# EAGLE design actuator (EAGLE 9.6.2)
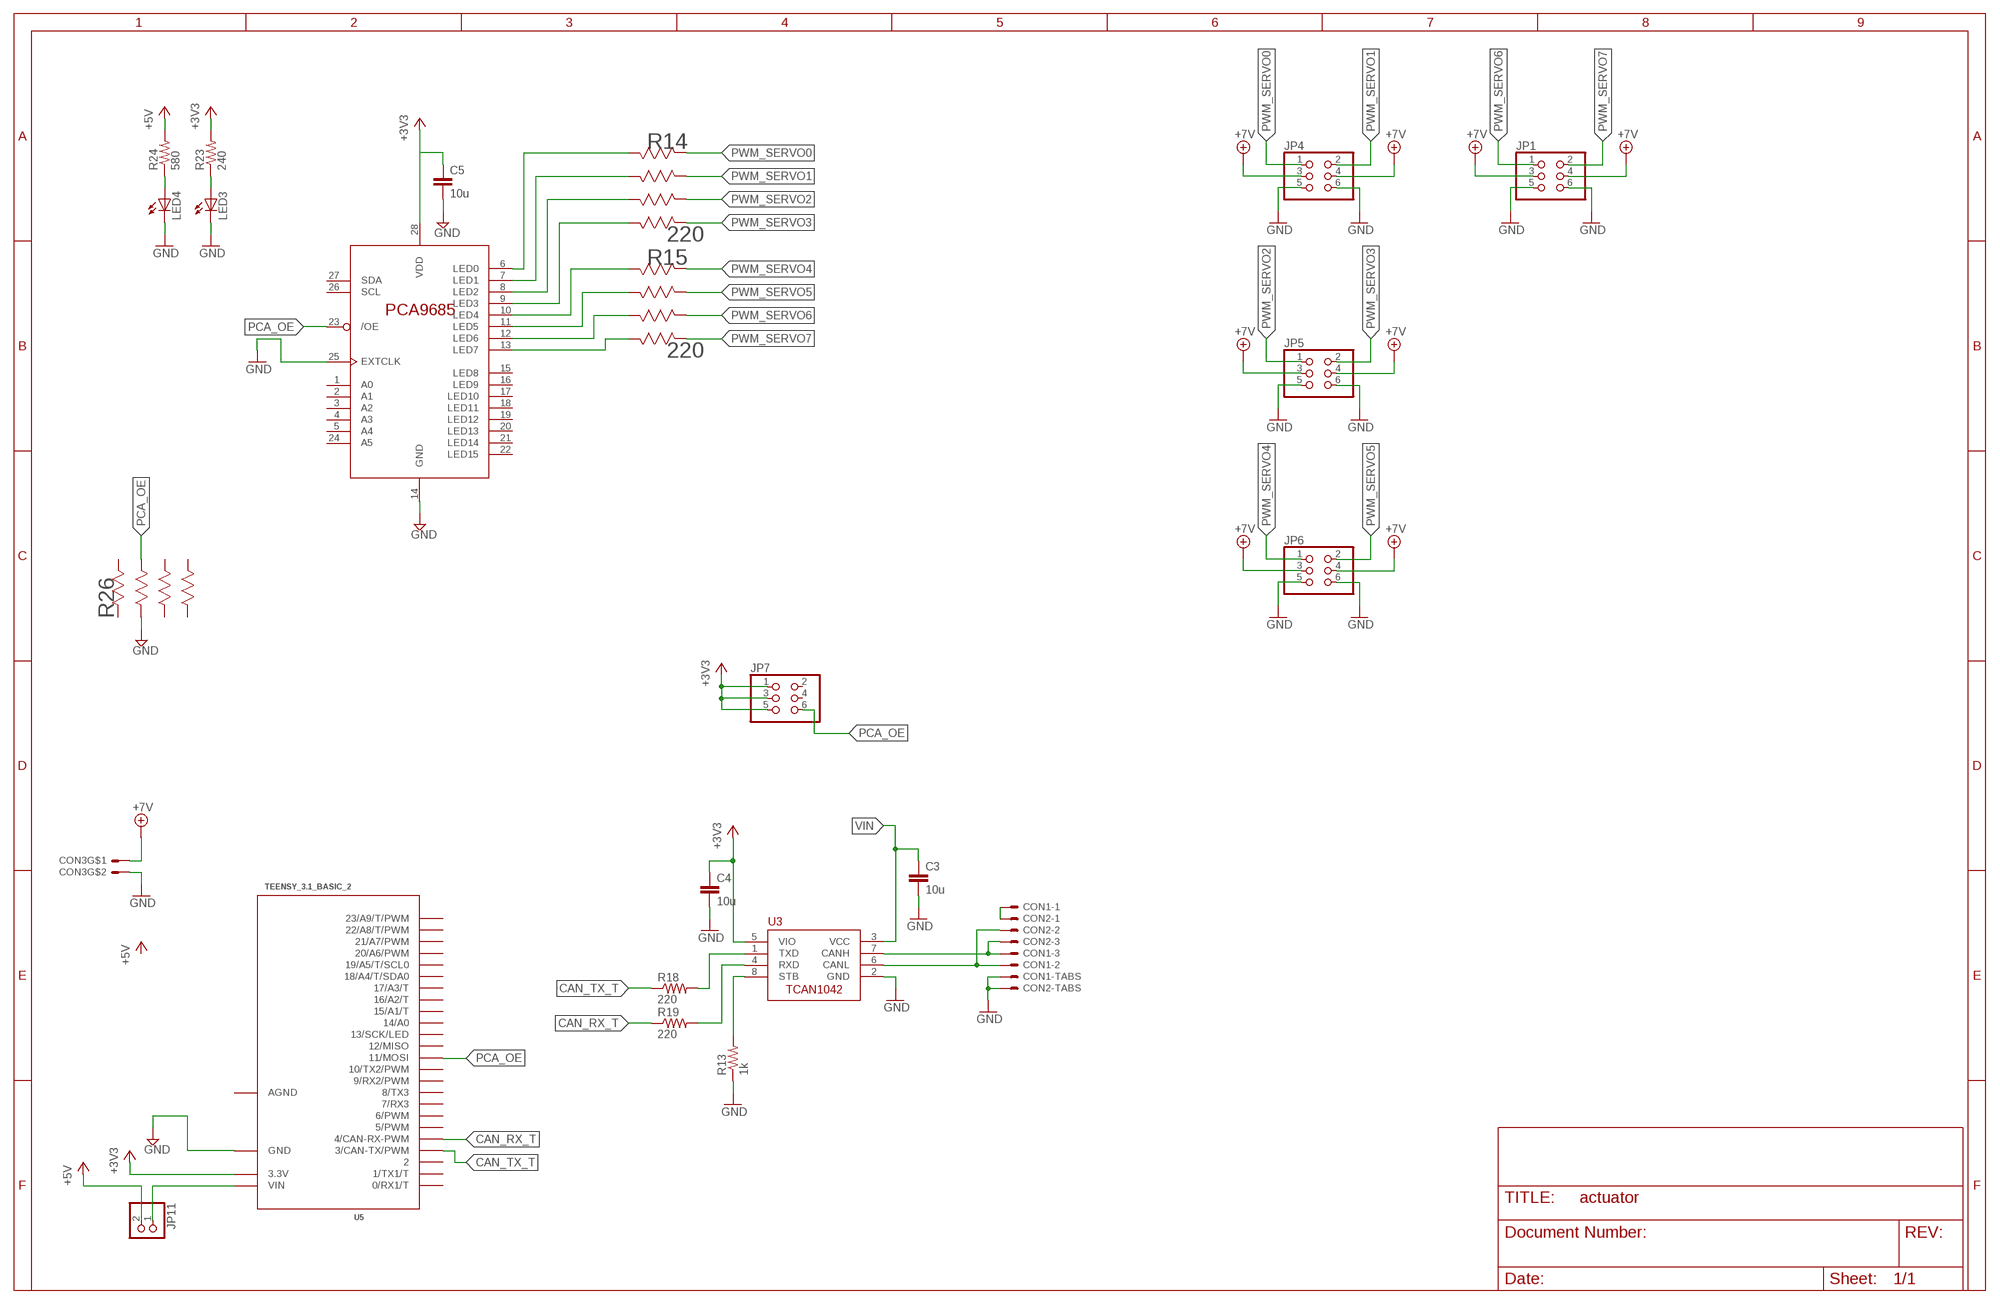
[diagram p0: schematic, sheet 1]

## Parts
C3  10u  C-EUC0805  [C0805]
C4  10u  C-EUC0805  [C0805]
C5  10u  C-EUC0805  [C0805]
CON1  SM03B-GHS-TB  [SM03B-GHS-TB]
CON2  SM03B-GHS-TB  [SM03B-GHS-TB]
CON3  MOLEX_5566-2  [5566-2]
JP1  PINHD-2X3  [2X03]
JP4  PINHD-2X3  [2X03]
JP5  PINHD-2X3  [2X03]
JP6  PINHD-2X3  [2X03]
JP7  PINHD-2X3  [2X03]
JP11  PINHD-1X2  [1X02]
LED3  LEDCHIPLED_1206  [CHIPLED_1206]
LED4  LEDCHIPLED_1206  [CHIPLED_1206]
R13  1k  R-US_R0805  [R0805]
R14  220  EXB-V8V221JVEXBV8V-M  [EXBV8V-M]
R15  220  EXB-V8V221JVEXBV8V-M  [EXBV8V-M]
R18  220  R-US_R0805  [R0805]
R19  220  R-US_R0805  [R0805]
R23  240  R-US_R1206  [R1206]
R24  580  R-US_R1206  [R1206]
R26  10k  EXB-V8V221JVEXBV8V-M  [EXBV8V-M]
U3  TCAN1042HVDR  [SO-8]
U4  PCA9685PW  [TSSOP28]
U5  TEENSY_3.1_BASIC_2  [TEENSY_3.1_BASIC_2]

## Nets
+3V3: C4.1 C5.1 JP7.1 JP7.3 JP7.5 R23.2 U3.5(VIO) U4.28(VDD) U5.3.3V
+5V: JP11.2 R24.2
+7V: CON3.1 JP1.3 JP1.4 JP4.3 JP4.4 JP5.3 JP5.4 JP6.3 JP6.4
CAN_RX: R19.2 U3.4(RXD)
CAN_RX_T: R19.1 U5.4(4/CAN-RX-PWM)
CAN_TX1: R18.2 U3.1(TXD)
CAN_TX_T: R18.1 U5.3(3/CAN-TX/PWM)
CANH: CON1.P$3 CON2.P$3 U3.7(CANH)
CANL: CON1.P$2 CON2.P$2 U3.6(CANL)
CANSH: CON1.P$1 CON2.P$1
GND [net1]: C3.2 C4.2 C5.2 CON1.P$4 CON1.P$5 CON2.P$4 CON2.P$5 CON3.2 JP1.5 JP1.6 JP4.5 JP4.6 JP5.5 JP5.6 JP6.5 JP6.6 LED3.C LED4.C R13.1 R26.2 U3.2(GND) U4.14(GND) U4.25(EXTCLK) U5.GND
N$3: LED3.A R23.1
N$4: LED4.A R24.1
PCA_OE: JP7.6 R26.7 U4.23(/OE) U5.11(11/MOSI)
PWM_CH0: R14.8 U4.6(LED0)
PWM_CH1: R14.7 U4.7(LED1)
PWM_CH2: R14.6 U4.8(LED2)
PWM_CH3: R14.5 U4.9(LED3)
PWM_CH4: R15.8 U4.10(LED4)
PWM_CH5: R15.7 U4.11(LED5)
PWM_CH6: R15.6 U4.12(LED6)
PWM_CH7: R15.5 U4.13(LED7)
PWM_SERVO0: JP4.1 R14.1
PWM_SERVO1: JP4.2 R14.2
PWM_SERVO2: JP5.1 R14.3
PWM_SERVO3: JP5.2 R14.4
PWM_SERVO4: JP6.1 R15.1
PWM_SERVO5: JP6.2 R15.2
PWM_SERVO6: JP1.1 R15.3
PWM_SERVO7: JP1.2 R15.4
STB: R13.2 U3.8(STB)
VIN: C3.1 JP11.1 U3.3(VCC) U5.VIN
Unconnected: JP7.2 JP7.4 R26.1 R26.3 R26.4 R26.5 R26.6 R26.8 U4.1(A0) U4.2(A1) U4.3(A2) U4.4(A3) U4.5(A4) U4.15(LED8) U4.16(LED9) U4.17(LED10) U4.18(LED11) U4.19(LED12) U4.20(LED13) U4.21(LED14) U4.22(LED15) U4.24(A5) U4.26(SCL) U4.27(SDA) U5.0(0/RX1/T) U5.1(1/TX1/T) U5.2 U5.5(5/PWM) U5.6(6/PWM) U5.7(7/RX3) U5.8(8/TX3) U5.9(9/RX2/PWM) U5.10(10/TX2/PWM) U5.12(12/MISO) U5.13(13/SCK/LED) U5.14/A0 U5.15/A1(15/A1/T) U5.16/A2(16/A2/T) U5.17/A3(17/A3/T) U5.18/A4(18/A4/T/SDA0) U5.19/A5(19/A5/T/SCL0) U5.20/A6(20/A6/PWM) U5.21/A7(21/A7/PWM) U5.22/A8(22/A8/T/PWM) U5.23/A9(23/A9/T/PWM)

## Power pins joined to a net without a drawn wire
AGND: U5.AGND

## Library data of the parts
C3-C5 = rcl:C-EU: CAPACITOR, European symbol
CON1 CON2 = ARVP:SM03B-GHS-TB
CON3 = ARVP:MOLEX_5566-2
JP1 JP4-JP7 = pinhead:PINHD-2X3: PIN HEADER
JP11 = pinhead:PINHD-1X2: PIN HEADER
LED3 LED4 = led:LED: LED OSRAM: - CHIPLED LG R971, LG N971, LY N971, LG Q971, LY Q971, LO R971, LY R971 LH N974, LH R974 LS Q976, LO Q976, LY Q976 LO Q996 - Hyper CHIPLED LW Q18S LB Q993, LB Q99A, LB R99A - SideLED LS A670, LO A670, LY A670, LG A670, LP A670 LB A673, LV A673, LT A673, LW A673 LH A674 LY A675 LS A676, LA A676, LO A676, LY A676, LW A676 LS A679, LY A679, LG A679 - Hyper Micro SIDELED® LS Y876, LA Y876, LO Y876, LY Y876 LT Y87S - SmartLED LW L88C, LW L88S LB L89C, LB L89S, LG L890 LS L89K, LO L89K, LY L89K LS L896, LA L896, LO L896, LY L896 - TOPLED LS T670, LO T670, LY T670, LG T670, LP T670 LSG T670, LSP T670, LSY T670, LOP T670, LYG T670 LG T671, LOG T671, LSG T671 LB T673, LV T673, LT T673, LW T673 LH T674 LS T676, LA T676, LO T676, LY T676, LB T676, LH T676, LSB T676, LW T676 LB T67C, LV T67C, LT T67C, LS T67K, LO T67K, LY T67K, LW E67C LS E67B, LA E67B, LO E67B, LY E67B, LB E67C, LV E67C, LT E67C LW T67C LS T679, LY T679, LG T679 LS T770, LO T770, LY T770, LG T770, LP T770 LB T773, LV T773, LT T773, LW T773 LH T774 LS E675, LA E675, LY E675, LS T675 LS T776, LA T776, LO T776, LY T776, LB T776 LHGB T686 LT T68C, LB T68C - Hyper Mini TOPLED® LB M676 - Mini TOPLED Santana® LG M470 LS M47K, LO M47K, LY M47K Source: http://www.osram.convergy.de LUXEON: - LUMILED® LXK2-PW12-R00, LXK2-PW12-S00, LXK2-PW14-U00, LXK2-PW14-V00 LXK2-PM12-R00, LXK2-PM12-S00, LXK2-PM14-U00 LXK2-PE12-Q00, LXK2-PE12-R00, LXK2-PE12-S00, LXK2-PE14-T00, LXK2-PE14-U00 LXK2-PB12-K00, LXK2-PB12-L00, LXK2-PB12-M00, LXK2-PB14-N00, LXK2-PB14-P00, LXK2-PB14-Q00 LXK2-PR12-L00, LXK2-PR12-M00, LXK2-PR14-Q00, LXK2-PR14-R00 LXK2-PD12-Q00, LXK2-PD12-R00, LXK2-PD12-S00 LXK2-PH12-R00, LXK2-PH12-S00 LXK2-PL12-P00, LXK2-PL12-Q00, LXK2-PL12-R00 Source: www.luxeon.com KINGBRIGHT: KA-3528ASYC Source: www.kingbright.com
R13 R18 R19 R23 R24 = rcl:R-US_: RESISTOR, American symbol
R14 R15 R26 = ARVP:EXB-V8V221JV; MANUFACTURER_PART_NUMBER: EXBV8V221JV; VENDOR: Panasonic
U3 = ARVP:TCAN1042HVDR
U4 = dropper_torpedo_v3:PCA9685
U5 = Teensy_3_Series_Board_v1.0:TEENSY_3.1_BASIC_2: Footprint for Teensy 3.1 board using all pin connections on the outer perimeter

## Net classes
1 net1: clearance 0.203 mm to class 0

## Board
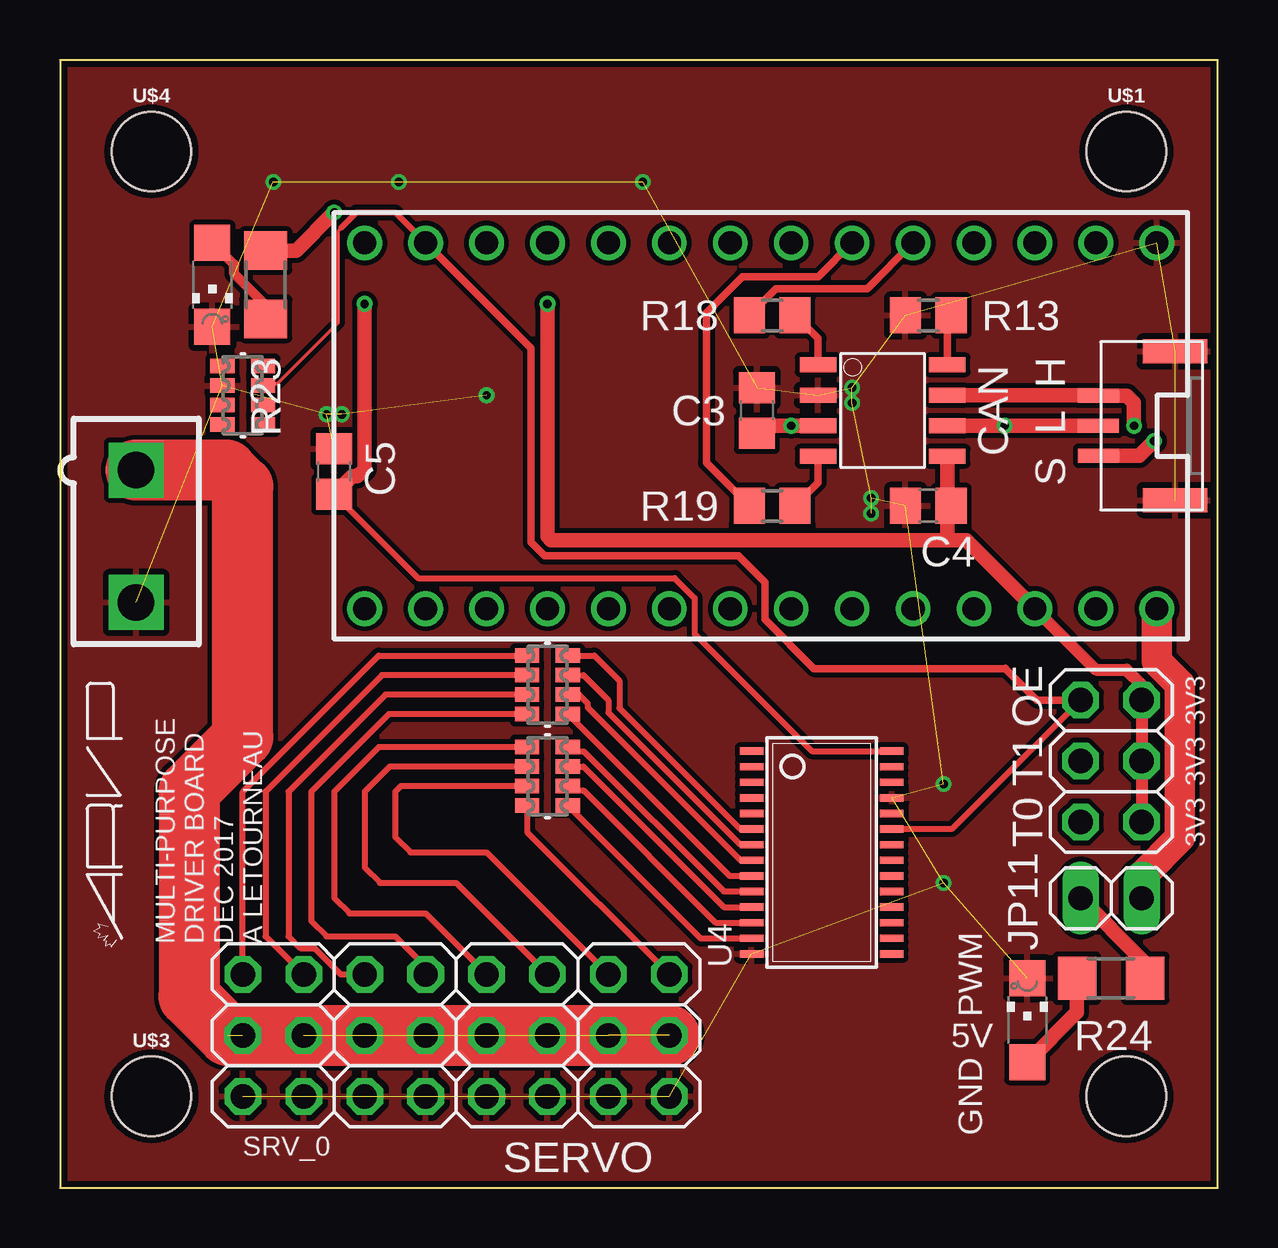
[diagram p1: board, top side]
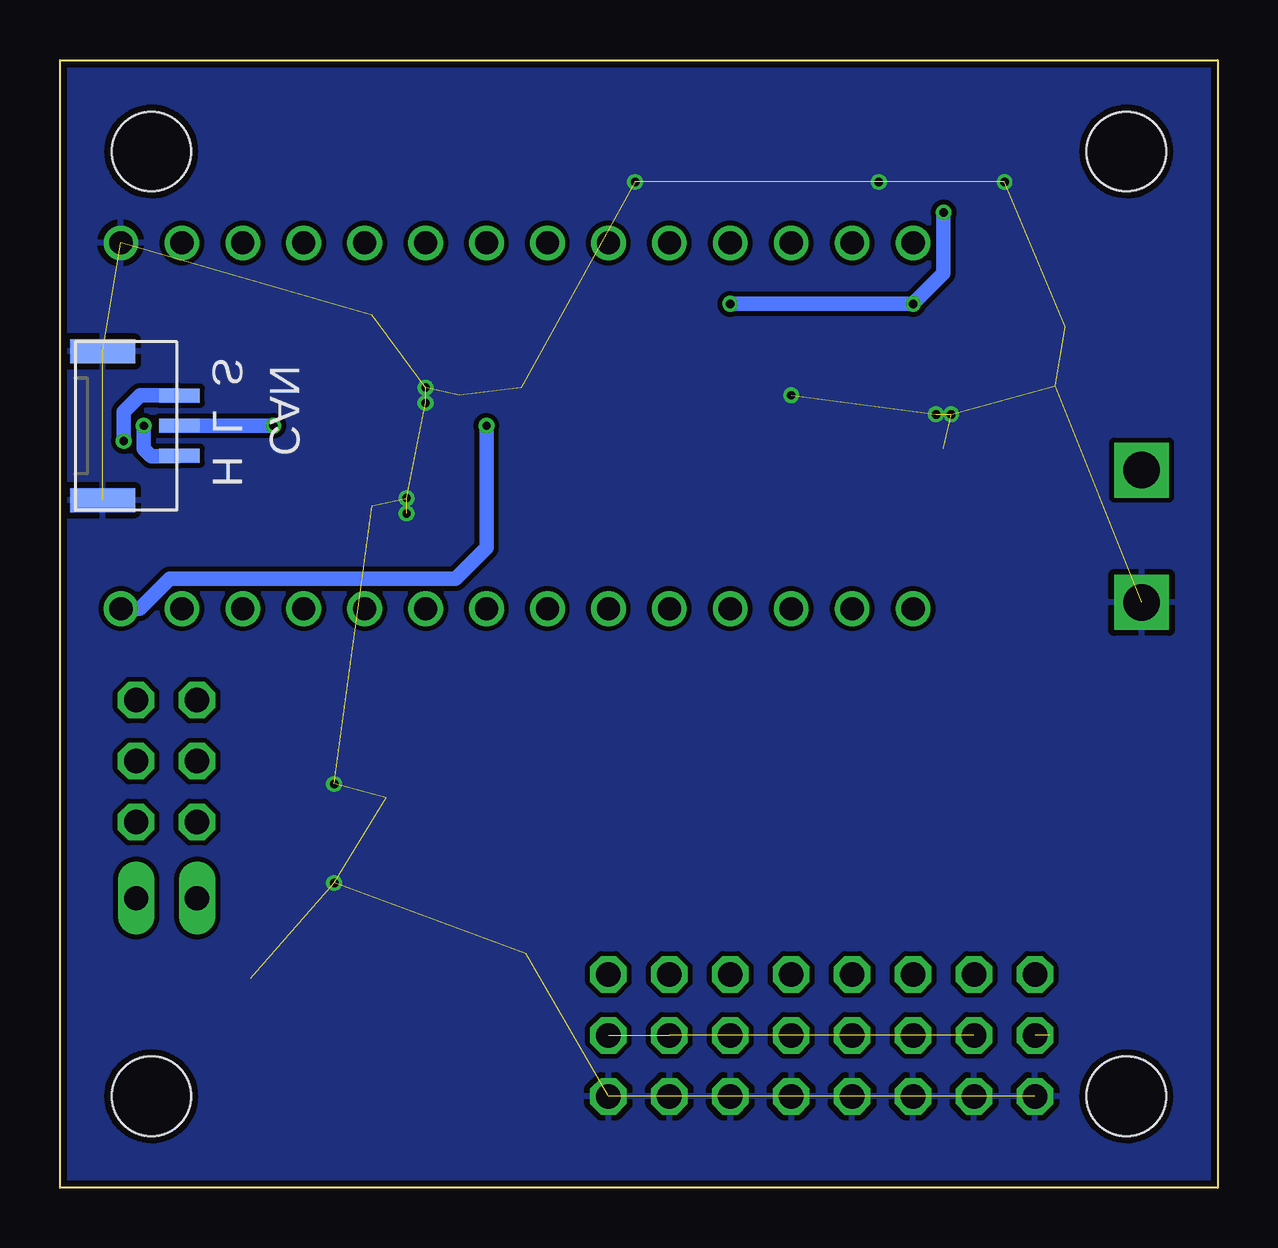
[diagram p2: board, bottom side, seen from below]

Size 48.26 x 46.99 mm. Coordinates in mm from the lower left corner, seen from the top.
Outline: 0,0 48.26,0 48.26,46.99 0,46.99 0,0
Copper layers (1*16): Top 0.035mm / dielectric 1.5mm / Bottom 0.035mm
Design rules "ITEADstudioDRC": minimum track width 6mil, minimum drill 12mil, track to track 8mil, track to pad 8mil, pad to pad 8mil, via to via 8mil, smd to smd 0mil, copper to edge 10mil, drill to drill 10mil, minimum pad ring 6mil, minimum via ring 6mil, stop-mask expansion 2mil, vias tented up to drill 100mil, thermal gap 10mil
Milling: 4 lines

### Footprints (pad centres in the part's own frame; a part is rotated, then mirrored left to right if it is on the bottom)
C0805 = smd 1.3 x 1.5: 1 -0.95,0; 2 0.95,0
SM03B-GHS-TB = smd 0.6 x 1.7: P$1 -1.25,0.85; P$2 0,0.85; P$3 1.25,0.85 | smd 1 x 2.7: P$4 -3.1,-2.35; P$5 3.1,-2.35
5566-2 = drill 1.524 square: 1 0,-2.756; 2 0,2.756
2X03 = drill 1.016 octagon: 1 -2.54,-1.27; 2 -2.54,1.27; 3 0,-1.27; 4 0,1.27; 5 2.54,-1.27; 6 2.54,1.27
1X02 = drill 1.016 long: 1 -1.27,0; 2 1.27,0
CHIPLED_1206 = smd 1.5 x 1.5: A 0,-1.75; C 0,1.75
R0805 = smd 1.3 x 1.5: 1 -0.95,0; 2 0.95,0
EXBV8V-M = smd 1.016 x 0.61: 1 -0.851,1.219; 2 -0.851,0.406; 3 -0.851,-0.406; 4 -0.851,-1.219; 5 0.851,-1.219; 6 0.851,-0.406; 7 0.851,0.406; 8 0.851,1.219
R1206 = smd 1.6 x 1.803: 1 -1.422,0; 2 1.422,0
SO-8 = smd 1.524 x 0.61: 1 -2.692,1.905; 2 -2.692,0.635; 3 -2.692,-0.635; 4 -2.692,-1.905; 5 2.692,-1.905; 6 2.692,-0.635; 7 2.692,0.635; 8 2.692,1.905
TSSOP28 = smd 0.305 x 0.991: 1 -4.225,-2.918; 2 -3.575,-2.918; 3 -2.925,-2.918; 4 -2.275,-2.918; 5 -1.625,-2.918; 6 -0.975,-2.918; 7 -0.325,-2.918; 8 0.325,-2.918; 9 0.975,-2.918; 10 1.625,-2.918; 11 2.275,-2.918; 12 2.925,-2.918; 13 3.575,-2.918; 14 4.225,-2.918; 15 4.225,2.918; 16 3.575,2.918; 17 2.925,2.918; 18 2.275,2.918; 19 1.625,2.918; 20 0.975,2.918; 21 0.325,2.918; 22 -0.325,2.918; 23 -0.975,2.918; 24 -1.625,2.918; 25 -2.275,2.918; 26 -2.925,2.918; 27 -3.575,2.918; 28 -4.225,2.918
TEENSY_3.1_BASIC_2 = drill 0.965: 0 -7.62,13.97; 1 -7.62,11.43; 2 -7.62,8.89; 3 -7.62,6.35; 3.3V 7.62,11.43; 4 -7.62,3.81; 5 -7.62,1.27; 6 -7.62,-1.27; 7 -7.62,-3.81; 8 -7.62,-6.35; 9 -7.62,-8.89; 10 -7.62,-11.43; 11 -7.62,-13.97; 12 -7.62,-16.51; 13 7.62,-16.51; 14/A0 7.62,-13.97; 15/A1 7.62,-11.43; 16/A2 7.62,-8.89; 17/A3 7.62,-6.35; 18/A4 7.62,-3.81; 19/A5 7.62,-1.27; 20/A6 7.62,1.27; 21/A7 7.62,3.81; 22/A8 7.62,6.35; 23/A9 7.62,8.89; AGND 7.62,13.97; GND -7.62,16.51; VIN 7.62,16.51
STAND-OFF = hole 3.302: 0,0

### Placement (x,y rotation side)
C3  29.05,32.38 90 top
C4  36.2,28.42 180 top
C5  11.43,29.84 90 top
CON1  44.13,31.75 90 top
CON2  44.13,31.75 270 bottom
CON3  3.17,27.15 180 top
JP1  24.13,6.35 270 top
JP4  8.89,6.35 270 top
JP5  13.97,6.35 270 top
JP6  19.05,6.35 270 top
JP7  43.81,17.78 90 top
JP11  43.81,12.06 180 top
LED3  6.35,37.62 180 top
LED4  40.32,6.99 0 top
R13  36.2,36.35 0 top
R14  20.32,20.95 0 top
R15  20.32,17.14 0 top
R18  29.69,36.35 0 top
R19  29.69,28.42 0 top
R23  8.57,37.62 90 top
R24  43.81,8.73 0 top
R26  7.62,33.02 0 top
U3  34.29,32.38 0 top
U4  31.75,13.97 270 top
U5  29.21,31.75 270 top
U$1  [STAND-OFF]  44.45,43.18 0 top
U$3  [STAND-OFF]  3.81,3.81 0 top
U$4  [STAND-OFF]  3.81,43.18 0 top
U$5  [LOGO3]  2.54,10.16 90 top
U$6  [LETTER_L]  -82.55,-72.39 0 top  (outside the outline)
U$7  [DOCFIELD]  64.77,-72.39 0 top  (outside the outline)
U$8  [STAND-OFF]  44.45,3.81 0 top

### Tracks (layer width: path | path; a pad name or v marks a point on that pad's centre or on a via)
+3V3  (via drill 0.35)
  Top 0.152: C4.1 36.99,28.26
  Top 0.254: C5.1 14.93,25.4 25.62,25.4 26.45,24.57 26.45,23.08 31.34,18.2 U4.28
  Top 0.508: U5.3.3V 43.18,21.59 44.45,21.59 45.09,20.95 JP7.5 JP7.3 JP7.1
  Top 0.61: U3.5 36.98,28.58 C4.1 | C5.1 12.17,29.64 12.39,29.64 12.7,29.95 v12.7,36.83 | U5.3.3V 37.78,26.99 36.99,26.99 | 36.99,26.99 20.48,26.99 20.32,27.15 v20.32,36.83 | 36.99,28.26 36.99,26.99 | v11.43,40.64 9.84,39.05 R23.2
  Bottom 0.61: v11.43,40.64 11.43,38.1 v12.7,36.83 v20.32,36.83
+5V
  Top 0.152: 43.81,10.78 43.81,10.79
  Top 0.61: R24.2 45.24,9.36 43.81,10.78 | 43.81,10.79 JP11.2
  Top 1.27: 45.24,8.89 R24.2
+7V  (7 unrouted)
  Top 2.54: CON3.1 6.93,29.9 7.62,29.21 7.62,18.77 5.38,16.54 5.38,7.96 7,6.35 | JP4.3 JP1.4
CAN_RX
  Top 0.305: U3.4 31.6,29.38 R19.2
CAN_RX_T
  Top 0.305: U5.4 31.62,37.97 28.45,37.97 26.94,36.46 26.94,30.21 R19.1
CAN_TX1
  Top 0.305: U3.1 31.6,35.39 R18.2
CAN_TX_T
  Top 0.305: U5.3 33.65,37.46 29.84,37.46 29.63,37.25 R18.1
CANH  (via drill 0.35)
  Top 0.61: U3.7 43.26,33.02 CON1.P$3 44.47,33 44.77,32.7 v44.77,31.75
  Bottom 0.61: v44.77,31.75 44.77,30.8 44.45,30.48 43.3,30.48 CON2.P$3
CANL  (via drill 0.35)
  Top 0.61: U3.6 v39.37,31.75 CON2.P$2
  Bottom 0.61: CON2.P$2 v39.37,31.75
CANSH  (via drill 0.35)
  Top 0.61: CON1.P$1 44.99,30.5 v45.6,31.11
  Bottom 0.61: v45.6,31.11 45.6,32.34 44.93,33.02 43.3,33.02 CON2.P$1
GND  (via drill 0.35)  (33 unrouted)
  other vias: 36.83,12.7 8.89,41.91 33.81,28.73 33.81,28.1 33.02,33.34 33.02,32.7 11.11,32.23 11.75,32.23 17.78,33.02 14.13,41.91 36.83,16.83 24.29,41.91
  pour Bottom (rank 2): 0.32,0.32 47.94,0.32 47.94,46.67 0.32,46.67
  pour Top (rank 3): 0.32,0.32 47.94,0.32 47.94,46.67 0.32,46.67
  pour Top: 6.35,2.54 26.67,2.54 26.67,5.08 6.35,5.08
N$3
  Top 0.406: LED3.A 7.26,38.46 7.26,38.08 8.57,36.77 R23.1
N$4
  Top 0.61: LED4.A 42.39,7.31 R24.1
PCA_OE
  Top 0.152: R26.7 8.57,33.5 9.05,33.5 11.59,36.04 11.59,39.85 11.75,40.01 11.74,40.02
  Top 0.254: U5.11 13.97,40.64 12.36,40.64 11.74,40.02 | JP7.6 37.17,14.95 U4.23
  Top 0.305: U5.11 19.64,34.97 19.64,26.89 20.2,26.33 28.28,26.33 29.39,25.22 29.39,23.68 31.43,21.63 39.41,21.63 | JP7.6 40.72,20.32 39.41,21.63 | 39.4,21.64 39.41,21.63
PWM_CH0
  Top 0.254: R14.8 22.28,22.17 23.32,21.13 23.32,19.99 28.36,14.95 U4.6
PWM_CH1
  Top 0.152: 21.2,21.31 R14.7
  Top 0.254: R14.7 21.82,21.36 22.86,20.32 22.86,19.8 28.36,14.29 U4.7
PWM_CH2
  Top 0.254: U4.8 28.37,13.64 22.01,20 22.01,20.18 21.64,20.55 R14.6
PWM_CH3
  Top 0.254: R14.5 27.91,12.99 U4.9
PWM_CH4
  Top 0.254: R15.8 21.35,18.19 21.83,18.19 27.67,12.35 U4.10
PWM_CH5
  Top 0.254: R15.7 21.82,17.55 27.68,11.7 U4.11
PWM_CH6
  Top 0.254: R15.6 21.35,16.56 21.82,16.56 27.33,11.04 U4.12
PWM_CH7
  Top 0.254: R15.5 26.7,10.39 U4.13
PWM_SERVO0
  Top 0.254: JP4.1 7.62,16.51 13.28,22.17 R14.1
PWM_SERVO1
  Top 0.152: 19.42,21.31 R14.2
  Top 0.254: R14.2 13.42,21.36 8.57,16.51 8.57,10.48 JP4.2
PWM_SERVO2
  Top 0.254: R14.3 13.56,20.55 9.53,16.51 9.53,10.48 10.02,9.98 10.61,9.98 11.71,8.89 JP5.1
PWM_SERVO3
  Top 0.254: R14.4 13.7,19.74 10.48,16.51 10.48,11.11 11.11,10.48 13.97,10.48 15.24,9.21 JP5.2
PWM_SERVO4
  Top 0.254: R15.1 13.28,18.36 11.43,16.51 11.43,12.06 12.06,11.43 15.24,11.43 JP6.1
  Bottom 0.152: 17.75,8.93 JP6.1
PWM_SERVO5
  Top 0.254: R15.2 13.74,17.55 12.7,16.51 12.7,13.34 13.34,12.7 16.51,12.7 JP6.2
  Bottom 0.152: 20.24,8.93 JP6.2
PWM_SERVO6
  Top 0.254: R15.3 14.2,16.74 13.97,16.51 13.97,14.61 14.61,13.97 17.78,13.97 JP1.1
PWM_SERVO7
  Top 0.254: R15.4 19.47,14.82 JP1.2
STB
  Top 0.305: R13.2 36.98,36.19 U3.8
VIN  (via drill 0.35)
  Top 0.61: U3.3 v30.48,31.75 29.21,31.75 C3.1
  Top 1.27: JP11.1 45.09,12.98 46.69,14.58 46.69,20.98 45.72,21.95 U5.VIN
  Bottom 0.61: U5.VIN 44.94,24.13 43.7,25.38 31.77,25.38 30.48,26.67 v30.48,31.75

### Text on the board
tNames: H | CAN | L | S | OE | 3V3 | T1 | 3V3 | T0 | 3V3 | MULTI-PURPOSE / DRIVER BOARD / DEC 2017 / A LETOURNEAU | PWM | 5V | GND | SRV_0 | SERVO
bNames: S | CAN | L | H